# EAGLE design LB1 (EAGLE 9.6.2)
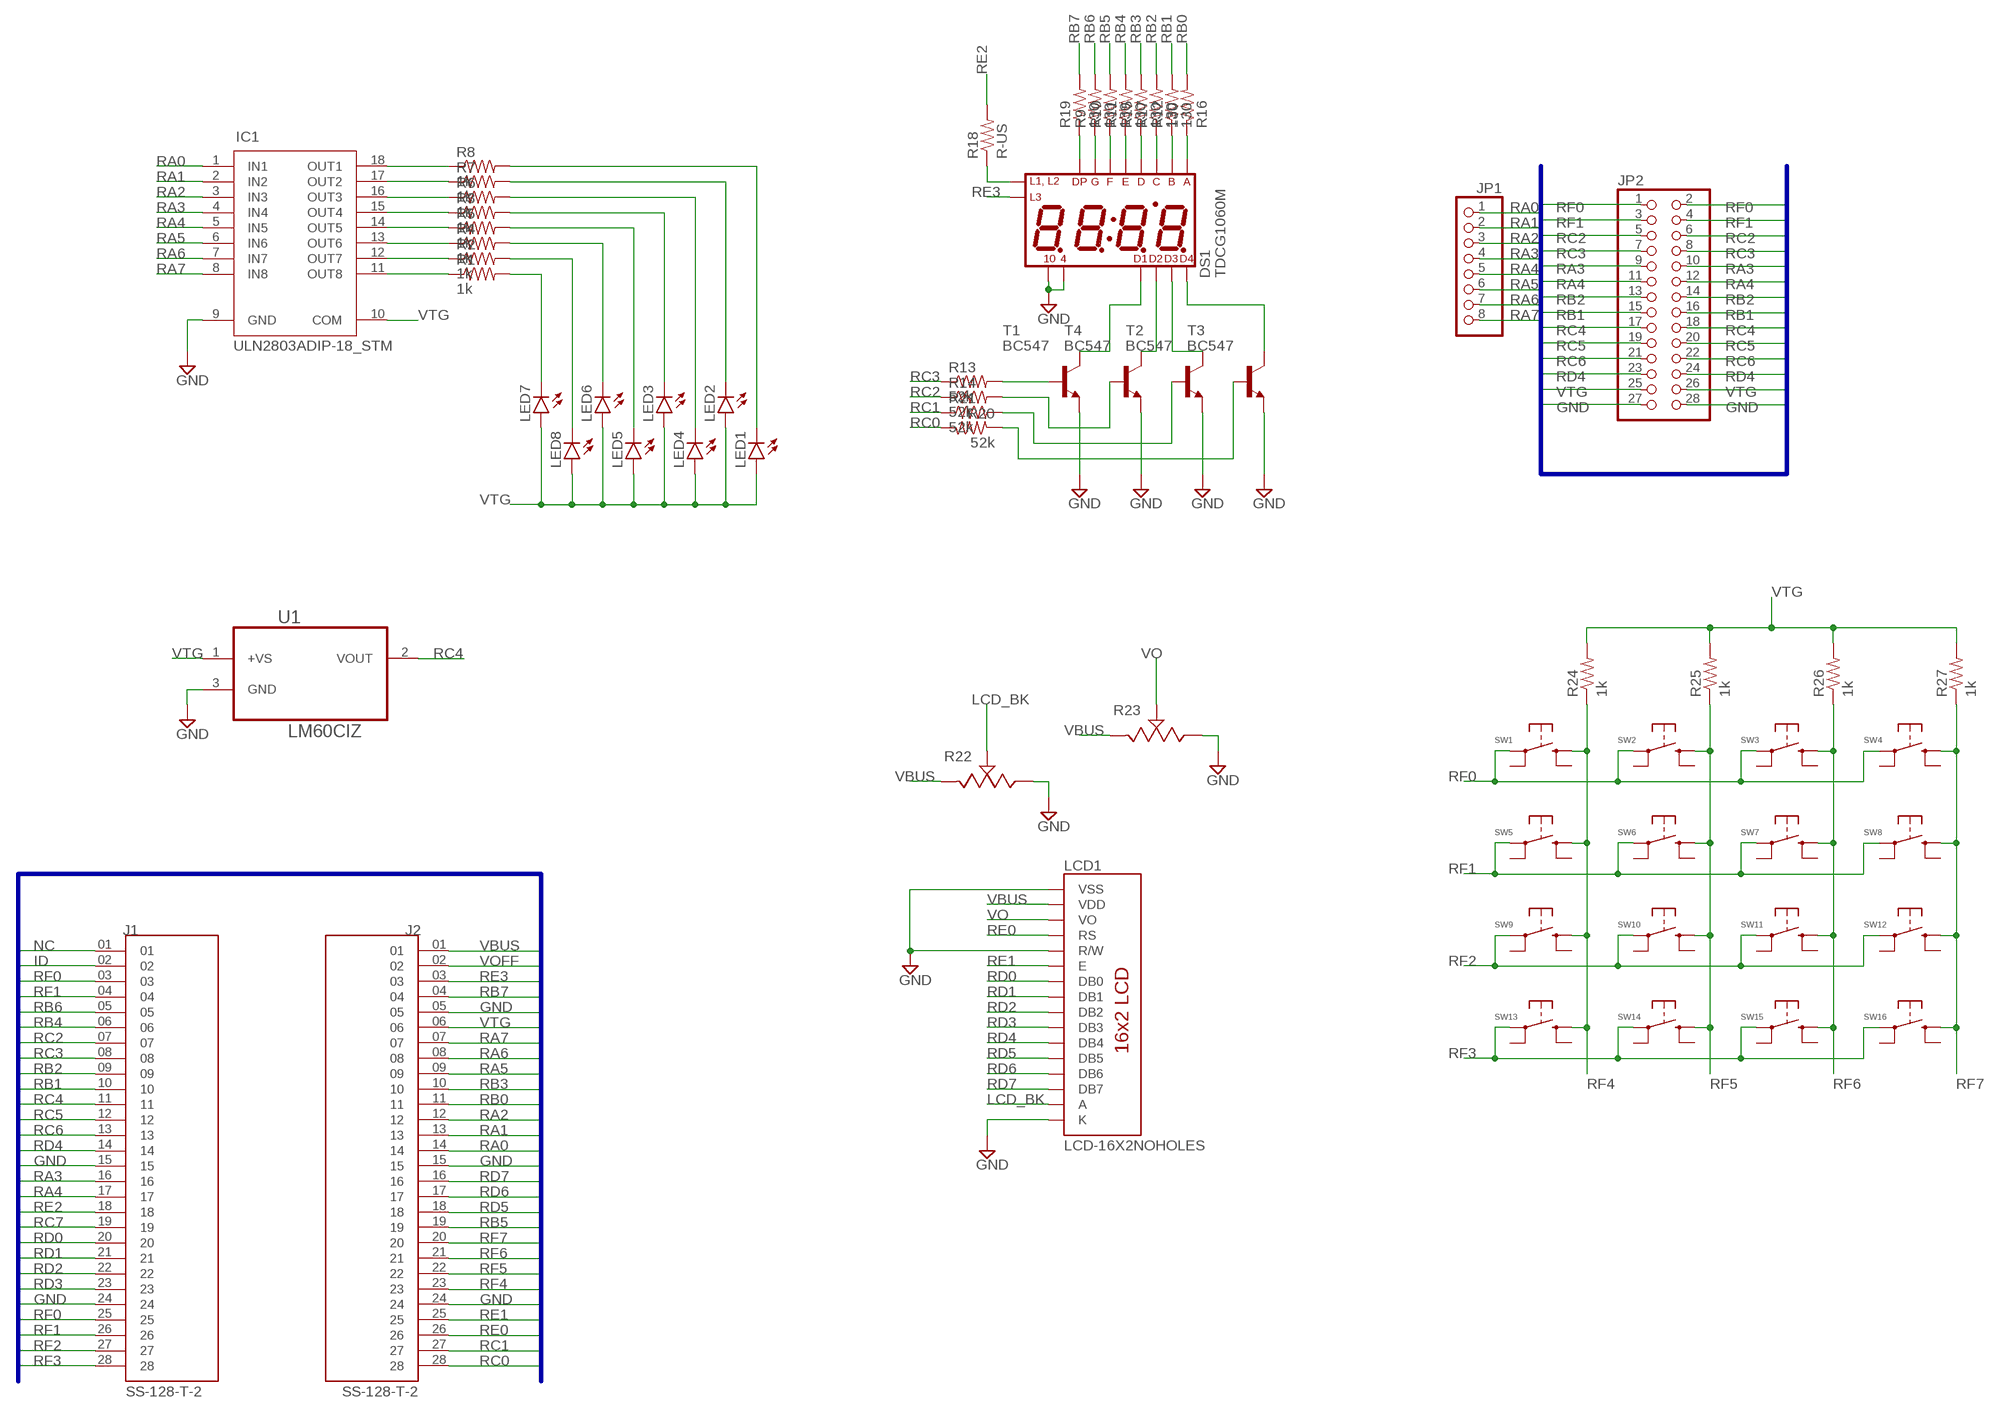
[diagram p0: schematic, sheet 1]

## Parts
DS1  TDCG1060M  [DISPLAY_TDCG1060M]
IC1  ULN2803ADIP-18_STM  [DIP-18_STM]
J1  SS-128-T-2  [SAMTEC_SS-128-T-2]
J2  SS-128-T-2  [SAMTEC_SS-128-T-2]
JP1  PINHD-1X8BIG  [1X08-BIG]
JP2  PINHD-2X14-CB  [2X14-BIG]
LCD1  LCD-16X2NOHOLES  [LCD-16X2_NOHOLESNOSILK]
LED1  LED3MM  [LED3MM]
LED2  LED3MM  [LED3MM]
LED3  LED3MM  [LED3MM]
LED4  LED3MM  [LED3MM]
LED5  LED3MM  [LED3MM]
LED6  LED3MM  [LED3MM]
LED7  LED3MM  [LED3MM]
LED8  LED3MM  [LED3MM]
R1  1k  R-US  [0207/10]
R2  1k  R-US  [0207/10]
R3  1k  R-US  [0207/10]
R4  1k  R-US  [0207/10]
R5  1k  R-US  [0207/10]
R6  1k  R-US  [0207/10]
R7  1k  R-US  [0207/10]
R8  1k  R-US  [0207/10]
R9  130  R-US  [0207/10]
R10  130  R-US  [0207/10]
R11  130  R-US  [0207/10]
R12  130  R-US  [0207/10]
R13  52k  R-US  [0207/10]
R14  52k  R-US  [0207/10]
R15  130  R-US  [0207/10]
R16  130  R-US  [0207/10]
R17  130  R-US  [0207/10]
R18  R-US  [0207/10]
R19  130  R-US  [0207/10]
R20  52k  R-US  [0207/10]
R21  52k  R-US  [0207/10]
R22  3362P-1-103LF  [3362P-1-103LF]
R23  3362P-1-103LF  [3362P-1-103LF]
R24  1k  R-US  [0207/10]
R25  1k  R-US  [0207/10]
R26  1k  R-US  [0207/10]
R27  1k  R-US  [0207/10]
SW1  1825910-2  [TE_1825910-2]
SW2  1825910-2  [TE_1825910-2]
SW3  1825910-2  [TE_1825910-2]
SW4  1825910-2  [TE_1825910-2]
SW5  1825910-2  [TE_1825910-2]
SW6  1825910-2  [TE_1825910-2]
SW7  1825910-2  [TE_1825910-2]
SW8  1825910-2  [TE_1825910-2]
SW9  1825910-2  [TE_1825910-2]
SW10  1825910-2  [TE_1825910-2]
SW11  1825910-2  [TE_1825910-2]
SW12  1825910-2  [TE_1825910-2]
SW13  1825910-2  [TE_1825910-2]
SW14  1825910-2  [TE_1825910-2]
SW15  1825910-2  [TE_1825910-2]
SW16  1825910-2  [TE_1825910-2]
T1  BC547  [TO92]
T2  BC547  [TO92]
T3  BC547  [TO92]
T4  BC547  [TO92]
U1  LM60CIZ  [TO92/]

## Nets
GND: DS1.4 DS1.10 IC1.9(GND) J1.15 J1.24 J2.05 J2.15 J2.24 JP2.27 JP2.28 LCD1.1(VSS) LCD1.5(R/W) LCD1.16(K) R22.3 R23.3 T1.1(E) T2.1(E) T3.1(E) T4.1(E) U1.3(GND)
ID: J1.02
LCD_BK: LCD1.15(A) R22.2
N$1: IC1.11(OUT8) R1.1
N$2: IC1.15(OUT4) R3.1
N$3: IC1.18(OUT1) R8.1
N$4: IC1.17(OUT2) R7.1
N$5: IC1.16(OUT3) R6.1
N$6: IC1.14(OUT5) R5.1
N$7: IC1.13(OUT6) R4.1
N$8: IC1.12(OUT7) R2.1
N$9: LED7.K(C) R1.2
N$10: LED8.K(C) R2.2
N$11: LED6.K(C) R4.2
N$12: LED5.K(C) R5.2
N$13: LED3.K(C) R3.2
N$14: LED4.K(C) R6.2
N$15: LED2.K(C) R7.2
N$16: LED1.K(C) R8.2
N$17: DS1.15(G) R9.1
N$18: DS1.7(DP) R19.1
N$20: DS1.5(E) R11.1
N$21: DS1.3(D) R15.1
N$22: DS1.13(C) R17.1
N$23: DS1.16(B) R12.1
N$24: DS1.14(A) R16.1
N$32: DS1.12(L1_L2) R18.1
N$35: R13.2 T1.2(B)
N$36: R14.2 T4.2(B)
N$37: R21.2 T2.2(B)
N$38: DS1.1(DIG1) T1.3(C)
N$39: R20.1 T3.2(B)
N$40: DS1.2(DIG2) T4.3(C)
N$41: DS1.6(DIG3) T2.3(C)
N$42: DS1.8(DIG4) T3.3(C)
NC: J1.01
RA0: IC1.1(IN1) J2.14 JP1.1
RA1: IC1.2(IN2) J2.13 JP1.2
RA2: IC1.3(IN3) J2.12 JP1.3
RA3: IC1.4(IN4) J1.16 JP1.4 JP2.9 JP2.10
RA4: IC1.5(IN5) J1.17 JP1.5 JP2.11 JP2.12
RA5: IC1.6(IN6) J2.09 JP1.6
RA6: IC1.7(IN7) J2.08 JP1.7
RA7: IC1.8(IN8) J2.07 JP1.8
RB0: J2.11 R16.2
RB1: J1.10 JP2.15 JP2.16 R12.2
RB2: J1.09 JP2.13 JP2.14 R17.2
RB3: J2.10 R15.2
RB4: J1.06 R11.2
RB5: J2.19 R10.2
RB6: DS1.11(F) J1.05 R9.2 R10.1
RB7: J2.04 R19.2
RC0: J2.28 R20.2
RC1: J2.27 R21.1
RC2: J1.07 JP2.5 JP2.6 R14.1
RC3: J1.08 JP2.7 JP2.8 R13.1
RC4: J1.11 JP2.17 JP2.18 U1.2(VOUT)
RC5: J1.12 JP2.19 JP2.20
RC6: J1.13 JP2.21 JP2.22
RC7: J1.19
RD0: J1.20 LCD1.7(DB0)
RD1: J1.21 LCD1.8(DB1)
RD2: J1.22 LCD1.9(DB2)
RD3: J1.23 LCD1.10(DB3)
RD4: J1.14 JP2.23 JP2.24 LCD1.11(DB4)
RD5: J2.18 LCD1.12(DB5)
RD6: J2.17 LCD1.13(DB6)
RD7: J2.16 LCD1.14(DB7)
RE0: J2.26 LCD1.4(RS)
RE1: J2.25 LCD1.6(E)
RE2: J1.18 R18.2
RE3: DS1.9(L3) J2.03
RF0: J1.03 J1.25 JP2.1 JP2.2 SW1.1(P) SW2.1(P) SW3.1(P) SW4.1(P)
RF1: J1.04 J1.26 JP2.3 JP2.4 SW5.1(P) SW6.1(P) SW7.1(P) SW8.1(P)
RF2: J1.27 SW9.1(P) SW10.1(P) SW11.1(P) SW12.1(P)
RF3: J1.28 SW13.1(P) SW14.1(P) SW15.1(P) SW16.1(P)
RF4: J2.23 R24.1 SW1.2(S) SW5.2(S) SW9.2(S) SW13.2(S)
RF5: J2.22 R25.1 SW2.2(S) SW6.2(S) SW10.2(S) SW14.2(S)
RF6: J2.21 R26.1 SW3.2(S) SW7.2(S) SW11.2(S) SW15.2(S)
RF7: J2.20 R27.1 SW4.2(S) SW8.2(S) SW12.2(S) SW16.2(S)
VBUS: J2.01 LCD1.2(VDD) R22.1 R23.1
VO: LCD1.3(VO) R23.2
VOFF: J2.02
VTG: IC1.10(COM) J2.06 JP2.25 JP2.26 LED1.A LED2.A LED3.A LED4.A LED5.A LED6.A LED7.A LED8.A R24.2 R25.2 R26.2 R27.2 U1.1(+VS)
Unconnected: SW1.3(P1) SW1.4(S1) SW2.3(P1) SW2.4(S1) SW3.3(P1) SW3.4(S1) SW4.3(P1) SW4.4(S1) SW5.3(P1) SW5.4(S1) SW6.3(P1) SW6.4(S1) SW7.3(P1) SW7.4(S1) SW8.3(P1) SW8.4(S1) SW9.3(P1) SW9.4(S1) SW10.3(P1) SW10.4(S1) SW11.3(P1) SW11.4(S1) SW12.3(P1) SW12.4(S1) SW13.3(P1) SW13.4(S1) SW14.3(P1) SW14.4(S1) SW15.3(P1) SW15.4(S1) SW16.3(P1) SW16.4(S1)

## Buses
MAIN_BUS:GND,ID,NC,RA[0..7],RB[0..7],RC[0..7],RD[0..7],RE[0..7],RF[0..7],VBUS,VOFF,VTG
SERIAL_COMMUNICATIONS:GND,ID,NC,RA[0..7],RB[0..7],RC[0..7],RD[0..7],RE[0..7],RF[0..7],VBUS,VOFF,VTG

## Library data of the parts
DS1 = TE2015_Microcontroladores:TDCG1060M: Clockmodule 10mm Green m.Plex c.c.-E4; DESCRIPTION: Display Modules - LED Character and Numeric Green 7-Segment Clock 4 Character Common Cathode 2V 20mA 0.504 H x 1.583 W x 0.276 D (12.80mm x 40.20mm x 7.00mm) 16-DIP (0.400, 10.16mm); DIGI-KEY_PART_NUMBER: TDCG1060M-ND; MF: Vishay; MP: TDCG1060M; PACKAGE: None; PURCHASE-URL: https://pricing.snapeda.com/search/part/TDCG1060M/?ref=eda
IC1 = TE2015_Microcontroladores:ULN2803A; COPYRIGHT: Copyright (C) 2022 Ultra Librarian. All rights reserved.; DIGI-KEY_PART_NUMBER_1: 497-2356-5-ND; MANUFACTURER_PART_NUMBER: ULN2803A; MFR_NAME: STMicroelectronics
J1 J2 = TE2015_Microcontroladores:SS-128-T-2; DESCRIPTION: 28 Position Receptacle Connector 0.100 (2.54mm) Through Hole Gold; DIGI-KEY_PART_NUMBER: SAM1117-28-ND; MF: Samtec; MP: SS-128-T-2; PACKAGE: None; PURCHASE-URL: https://pricing.snapeda.com/search/part/SS-128-T-2/?ref=eda
JP1 = TE2015_Microcontroladores:PINHD-1X8: PIN HEADER
JP2 = TE2015_Microcontroladores:PINHD-2X14: PIN HEADER
LCD1 = TE2015_Microcontroladores:LCD-16X2: Standard text-only 16x2 parallel input LCD Basic 16 character by 2 line display. Typically utilizes the extremely common HD44780 parallel interface chipset SparkFun Products: Basic 16x2 Green <https://www.sparkfun.com/products/255> Basic 8x2 Green <https://www.sparkfun.com/products/11122>; SF_ID: LCD-00255
LED1-LED8 = TE2015_Microcontroladores:LED3MM
R1-R21 R24-R27 = TE2015_Microcontroladores:R-US; SPICEPREFIX: R
R22 R23 = TE2015_Microcontroladores:3362P-1-103LF: TRIMMER 10K OHM 0.5W PC PIN TOP Manufacturer's datasheet <https://www.bourns.com/docs/Product-Datasheets/3362.pdf>; CREATED_PN: PCBLayout.com; DIGIKEY_PN: 3362P-103LF-ND; MANUFACTURER: Bourns Inc.; MPN: 3362P-1-103LF
SW1-SW16 = TE2015_Microcontroladores:1825910-2: SWITCH TACTILE SPST-NO 0.05A 24V Check availability <https://pricing.snapeda.com/parts/1825910-2/TE%20Connectivity/view-part?ref=eda>; AVAILABILITY: In Stock; COMMENT: 1825910-2; CONFIGURATION_POLE-THROW: Single Pole - Single Throw; CONTACT_CURRENT_RATING: 50 mA; DESCRIPTION: 50 mA SPST Round Actuator 160 Gram Force Tactile Pushbutton Switch; EU_ROHS_COMPLIANCE: Compliant; MF: TE Connectivity; MP: 1825910-2; PACKAGE: None; PRICE: None; PURCHASE-URL: https://pricing.snapeda.com/search/part/1825910-2/?ref=eda
T1-T4 = transistor:BC547: NPN TRANSISTOR
U1 = TE2015_Microcontroladores:LM60CIZ: IC, TEMPERATURE SENSOR, ± 3°C

## Board
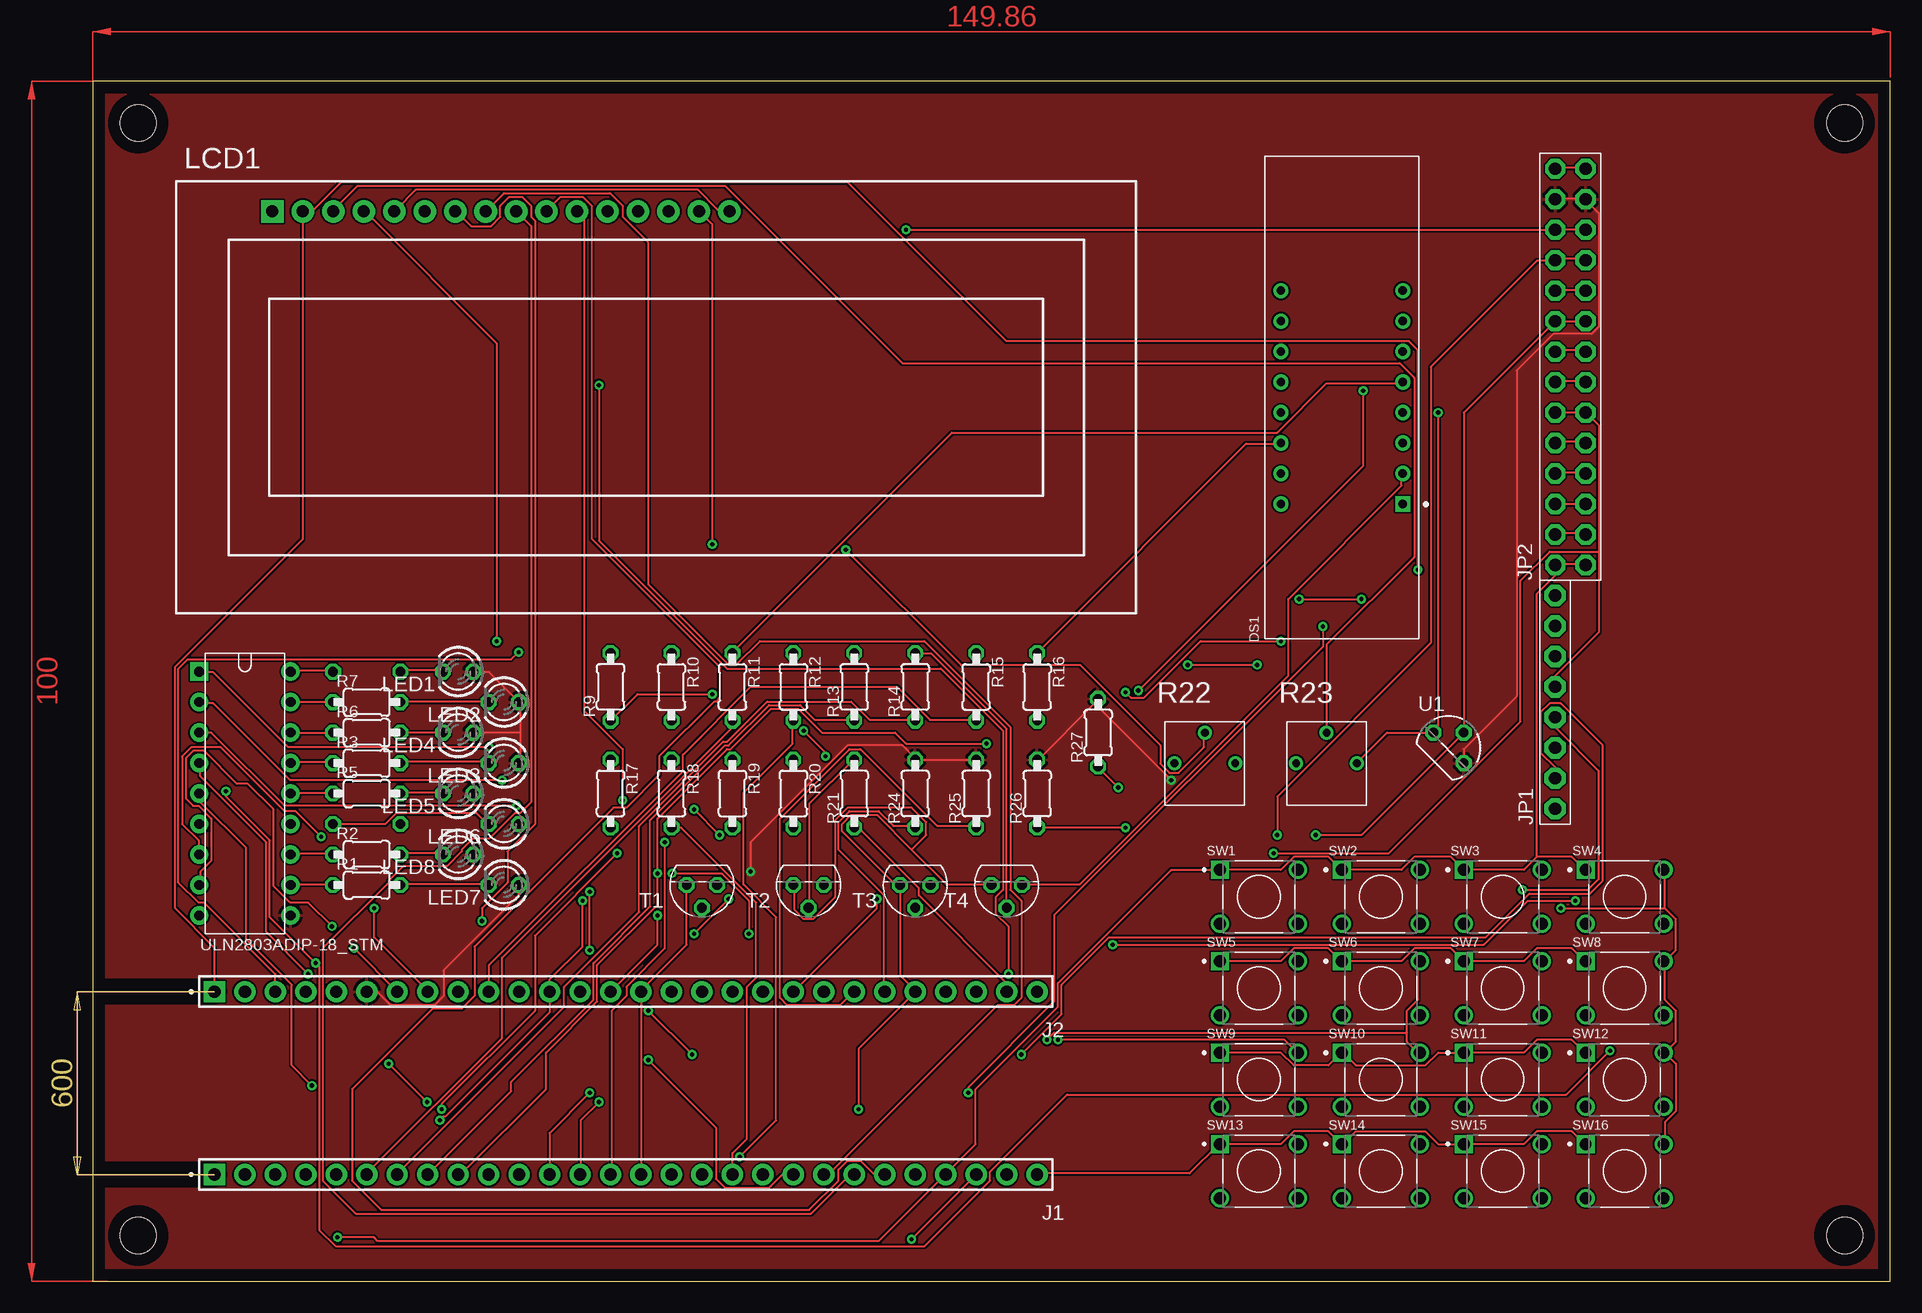
[diagram p1: board, top side]
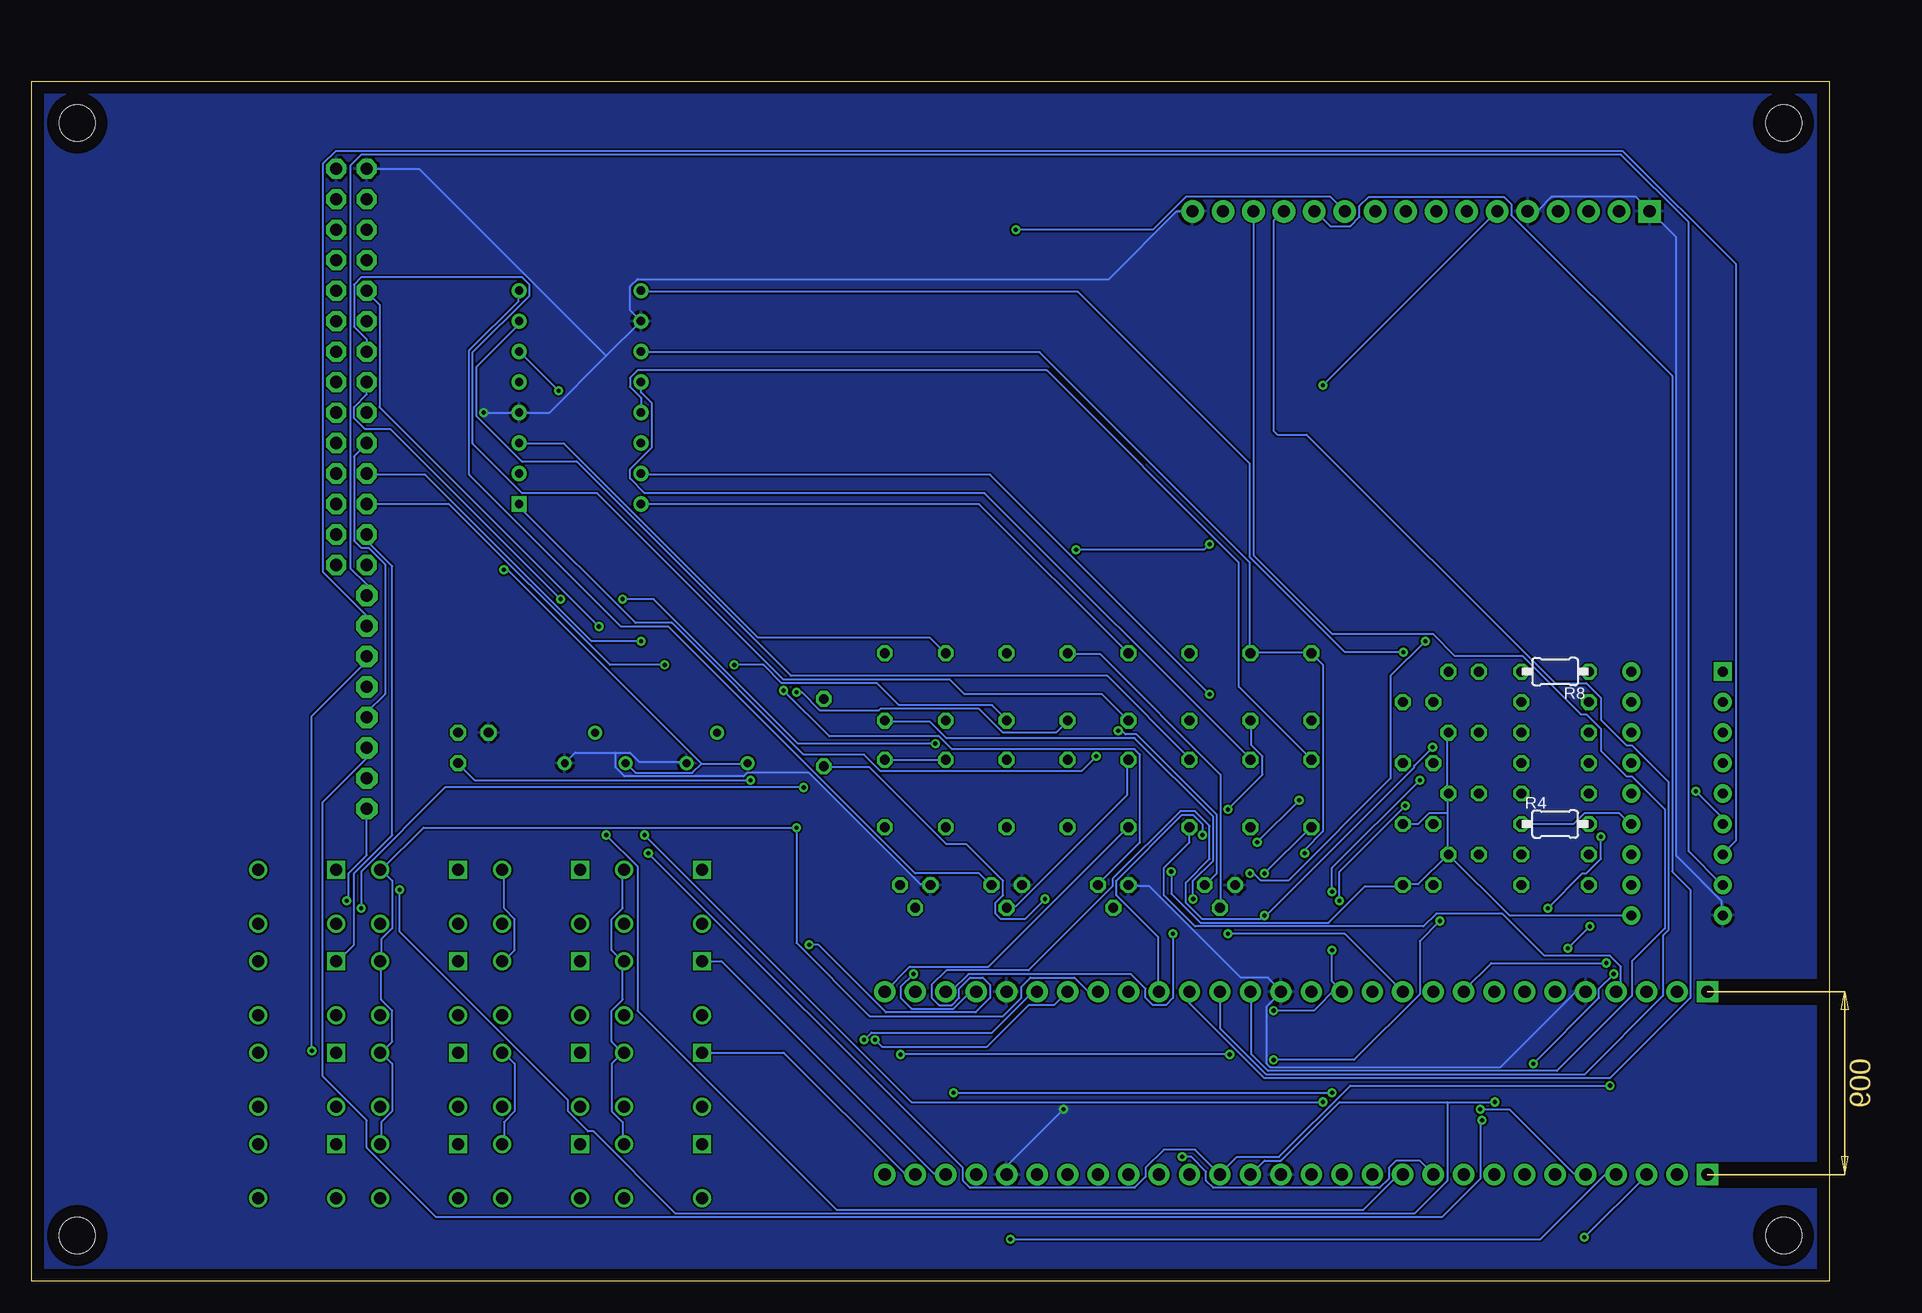
[diagram p2: board, bottom side, seen from below]

Size 149.84 x 100 mm. Coordinates in mm from the lower left corner, seen from the top.
Outline: 0,0 149.84,0 149.84,100 0,100 0,0
Copper layers (1*16): Top 0.035mm / dielectric 1.5mm / Bottom 0.035mm
Design rules "default": minimum track width 6mil, minimum drill 0.35mm, track to track 6mil, track to pad 6mil, pad to pad 6mil, via to via 6mil, smd to smd 6mil, copper to edge 40mil, drill to drill 6mil, minimum pad ring 10mil, minimum via ring 8mil, stop-mask expansion 4mil, vias tented up to drill 0mil, thermal gap 10mil
Holes 3 mm at 3.81,96.52 3.81,3.81 146.05,3.81 146.05,96.52

### Footprints (pad centres in the part's own frame; a part is rotated, then mirrored left to right if it is on the bottom)
DISPLAY_TDCG1060M = drill 0.7 pad 1.27 square: 1 -8.89,-5.08 | drill 0.7 pad 1.27: 2 -6.35,-5.08; 3 -3.81,-5.08; 4 -1.27,-5.08; 5 1.27,-5.08; 6 3.81,-5.08; 7 6.35,-5.08; 8 8.89,-5.08; 9 8.89,5.08; 10 6.35,5.08; 11 3.81,5.08; 12 1.27,5.08; 13 -1.27,5.08; 14 -3.81,5.08; 15 -6.35,5.08; 16 -8.89,5.08
DIP-18_STM = drill 0.813 pad 1.524 square: 1 0,0 | drill 0.813 pad 1.524: 2 0,-2.54; 3 0,-5.08; 4 0,-7.62; 5 0,-10.16; 6 0,-12.7; 7 0,-15.24; 8 0,-17.78; 9 0,-20.32; 10 7.62,-20.32; 11 7.62,-17.78; 12 7.62,-15.24; 13 7.62,-12.7; 14 7.62,-10.16; 15 7.62,-7.62; 16 7.62,-5.08; 17 7.62,-2.54; 18 7.62,0
SAMTEC_SS-128-T-2 = drill 1.016 pad 1.778 square: 01 0,0 | drill 1.016 pad 1.778: 02 -2.54,0; 03 -5.08,0; 04 -7.62,0; 05 -10.16,0; 06 -12.7,0; 07 -15.24,0; 08 -17.78,0; 09 -20.32,0; 10 -22.86,0; 11 -25.4,0; 12 -27.94,0; 13 -30.48,0; 14 -33.02,0; 15 -35.56,0; 16 -38.1,0; 17 -40.64,0; 18 -43.18,0; 19 -45.72,0; 20 -48.26,0; 21 -50.8,0; 22 -53.34,0; 23 -55.88,0; 24 -58.42,0; 25 -60.96,0; 26 -63.5,0; 27 -66.04,0; 28 -68.58,0
1X08-BIG = drill 1.016 pad 1.778 octagon: 1 -8.89,0; 2 -6.35,0; 3 -3.81,0; 4 -1.27,0; 5 1.27,0; 6 3.81,0; 7 6.35,0; 8 8.89,0
2X14-BIG = drill 1.016 pad 1.676 octagon: 1 -16.51,-1.27; 2 -16.51,1.27; 3 -13.97,-1.27; 4 -13.97,1.27; 5 -11.43,-1.27; 6 -11.43,1.27; 7 -8.89,-1.27; 8 -8.89,1.27; 9 -6.35,-1.27; 10 -6.35,1.27; 11 -3.81,-1.27; 12 -3.81,1.27; 13 -1.27,-1.27; 14 -1.27,1.27; 15 1.27,-1.27; 16 1.27,1.27; 17 3.81,-1.27; 18 3.81,1.27; 19 6.35,-1.27; 20 6.35,1.27; 21 8.89,-1.27; 22 8.89,1.27; 23 11.43,-1.27; 24 11.43,1.27; 25 13.97,-1.27; 26 13.97,1.27; 27 16.51,-1.27; 28 16.51,1.27
LCD-16X2_NOHOLESNOSILK = drill 1.016 pad 1.88 square: 1 -32,15.5 | drill 1.016 pad 1.88: 2 -29.46,15.5; 3 -26.92,15.5; 4 -24.38,15.5; 5 -21.84,15.5; 6 -19.3,15.5; 7 -16.76,15.5; 8 -14.22,15.5; 9 -11.68,15.5; 10 -9.14,15.5; 11 -6.6,15.5; 12 -4.06,15.5; 13 -1.52,15.5; 14 1.02,15.5; 15 3.56,15.5; 16 6.1,15.5
LED3MM = drill 0.813 octagon: A -1.27,0; K 1.27,0
0207/10 = drill 0.813 octagon: 1 -1.54,0; 2 4.08,0
3362P-1-103LF = drill 0.66: 1 -2.54,0; 2 0,2.54; 3 2.54,0
TE_1825910-2 = drill 0.99 square: 1 0,0 | drill 0.99: 2 6.5,0; 3 0,-4.5; 4 6.5,-4.5
TO92 = drill 0.813 octagon: 1 1.27,0; 2 0,1.905; 3 -1.27,0
TO92/ = drill 0.813 octagon: 1 1.27,-1.27; 2 1.27,1.27; 3 -1.27,1.27

### Placement (x,y rotation side)
DS1  104.14,73.66 90 top
IC1  8.89,50.8 0 top
J1  10.16,8.89 180 top
J2  10.16,24.13 180 top
JP1  121.92,48.26 90 top
JP2  123.19,76.2 90 top
LCD1  46.99,73.66 0 top
LED1  30.48,50.8 180 top
LED2  34.29,48.26 180 top
LED3  34.29,43.18 180 top
LED4  30.48,45.72 180 top
LED5  30.48,40.64 180 top
LED6  34.29,38.1 180 top
LED7  34.29,33.02 180 top
LED8  30.48,35.56 180 top
R1  21.59,33.02 0 top
R2  21.59,35.56 0 top
R3  21.59,43.18 0 top
R4  24.13,38.1 0 bottom
R5  21.59,40.64 0 top
R6  21.59,45.72 0 top
R7  21.59,48.26 0 top
R8  21.59,50.8 180 bottom
R9  43.18,48.26 90 top
R10  48.26,50.8 270 top
R11  53.34,50.8 270 top
R12  58.42,50.8 270 top
R13  63.5,48.26 90 top
R14  68.58,48.26 90 top
R15  73.66,50.8 270 top
R16  78.74,50.8 270 top
R17  43.18,41.91 270 top
R18  48.26,41.91 270 top
R19  53.34,41.91 270 top
R20  58.42,41.91 270 top
R21  63.5,39.37 90 top
R22  92.71,43.18 0 top
R23  102.87,43.18 0 top
R24  68.58,39.37 90 top
R25  73.66,39.37 90 top
R26  78.74,39.37 90 top
R27  83.82,44.45 90 top
SW1  93.98,34.29 0 top
SW2  104.14,34.29 0 top
SW3  114.3,34.29 0 top
SW4  124.46,34.29 0 top
SW5  93.98,26.67 0 top
SW6  104.14,26.67 0 top
SW7  114.3,26.67 0 top
SW8  124.46,26.67 0 top
SW9  93.98,19.05 0 top
SW10  104.14,19.05 0 top
SW11  114.3,19.05 0 top
SW12  124.46,19.05 0 top
SW13  93.98,11.43 0 top
SW14  104.14,11.43 0 top
SW15  114.3,11.43 0 top
SW16  124.46,11.43 0 top
T1  50.8,33.02 180 top
T2  59.69,33.02 180 top
T3  68.58,33.02 180 top
T4  76.2,33.02 180 top
U1  113.03,44.45 0 top

### Tracks (layer width: path | path; a pad name or v marks a point on that pad's centre or on a via)
GND  (via drill 0.35)
  Top 0.152: LCD1.16 53.03,89.31 52.12,89.31 50.44,90.98 26.98,90.98 25.3,89.31 LCD1.5 | T1.1 49.53,28.04 45.72,24.23 J2.15 J1.15 | JP2.28 121.92,92.81 124.36,92.81 JP2.27 | R23.3 105.46,43.28 107.9,45.72 U1.3 111.86,45.72 112.17,46.02 v112.17,72.39 | 68.28,35.97 65.38,38.86 63.25,38.86 62.48,38.1 62.48,37.49 66.9,33.07 67.21,33.07 T3.1 67.36,32.92 67.36,25.45 68.58,24.23 J2.24 68.58,24.08 63.86,19.36 v63.86,14.33 | 68.28,35.97 71.17,33.07 74.83,33.07 T4.1 | 68.28,35.97 69.49,37.19 69.49,38.25 68.28,39.47 62.94,39.47 61.87,38.41 61.87,32 60.05,30.18 59.28,30.18 58.52,30.94 58.52,32.92 T2.1
  Bottom 0.152: IC1.9 8.99,30.48 8.99,31.7 12.8,35.51 12.8,87.02 14.94,89.15 LCD1.1 15.09,89.31 16.15,90.37 23.16,90.37 24.23,89.31 25.15,89.31 LCD1.5 | T2.1 58.37,32.92 56.69,32.92 49.07,25.3 46.79,25.3 45.72,24.23 J2.15 45.72,24.08 46.94,22.86 46.94,18.14 46.63,17.83 27.43,17.83 21.18,24.08 20.42,24.08 J2.05 | 101.96,77.11 106.68,72.39 DS1.4 v112.17,72.39 | 101.96,77.11 DS1.10 99.97,80.92 99.97,82.91 99.36,83.52 60.05,83.52 54.41,89.15 53.19,89.15 LCD1.16 | 101.96,77.11 117.5,92.66 121.92,92.66 JP2.28 | 101.19,44.04 104.55,44.04 R23.3 | 101.19,44.04 99.97,44.04 99.21,43.28 95.25,43.28 R22.3 | J1.24 68.58,9.6 v63.86,14.33 | 101.19,44.04 101.19,42.82 100.43,42.06 90.53,42.06 90.22,42.37 85.04,42.37 75.74,33.07 74.98,33.07 T4.1
  pour Bottom: 0,100.33 0,0 149.86,0 149.86,100.33
LCD_BK  (via drill 0.35)
  Top 0.152: v62.79,60.96 72.39,51.36 82.3,51.36 89,44.65 89,43.13 89.76,42.37 90.53,42.37 92.66,44.5 92.66,45.72 R22.2 | v51.66,61.42 51.66,88.09 50.6,89.15 LCD1.15
  Bottom 0.152: v62.79,60.96 52.12,60.96 v51.66,61.42
N$1
  Top 0.152: R1.1 19.96,33.07 16.61,33.07 IC1.11
N$2
  Top 0.152: R3.1 19.96,43.28 16.61,43.28 IC1.15
N$3
  Top 0.152: R8.1 19.96,50.9 16.61,50.9 IC1.18
N$4
  Top 0.152: R7.1 19.96,48.31 16.61,48.31 IC1.17
N$5
  Top 0.152: IC1.16 R6.1
N$6
  Top 0.152: R5.1 19.96,40.69 16.61,40.69 IC1.14
N$7
  Bottom 0.152: R4.1 21.34,38.1 20.42,39.01 17.53,39.01 16.61,38.1 IC1.13
N$8
  Top 0.152: R2.1 19.96,35.66 16.61,35.66 IC1.12
N$9
  Top 0.152: R1.2 25.76,33.07 32.92,33.07 LED7.K
N$10
  Top 0.152: R2.2 25.76,35.66 29.11,35.66 LED8.K
N$11
  Top 0.152: R4.2 24.38,38.1 25.3,39.01 32,39.01 32.92,38.1 LED6.K
N$12
  Top 0.152: R5.2 25.76,40.69 29.11,40.69 LED5.K
N$13
  Top 0.152: R3.2 25.76,43.28 32.92,43.28 LED3.K
N$14
  Top 0.152: LED4.K R6.2
N$15
  Top 0.152: R7.2 25.76,48.31 32.92,48.31 LED2.K
N$16
  Top 0.152: R8.2 25.76,50.9 29.11,50.9 LED1.K
N$17  (via drill 0.35)
  Top 0.152: v51.66,48.92 45.41,48.92 43.28,46.79 R9.1
  Bottom 0.152: v51.66,48.92 69.95,67.21 99.06,67.21 DS1.15
N$18
  Bottom 0.152: DS1.7 109.27,80.01 109.27,79.7 112.78,76.2 112.78,72.08 108.97,68.28 104.39,68.28 86.56,50.44 60.2,50.44 53.34,43.59 R19.1
N$20
  Top 0.152: DS1.5 109.12,74.83 102.87,74.83 98.75,70.71 71.63,70.71 53.34,52.43 R11.1
N$21
  Bottom 0.152: DS1.3 109.12,69.8 105.46,69.8 89.31,53.65 74.98,53.65 73.76,52.43 R15.1
N$22
  Bottom 0.152: DS1.13 99.06,73.61 99.97,74.52 99.97,75.29 99.36,75.89 65.23,75.89 49.23,59.89 49.23,49.53 43.28,43.59 R17.1
N$23
  Bottom 0.152: DS1.16 70.87,64.77 58.52,52.43 R12.1
N$24
  Top 0.152: DS1.14 99.06,69.8 96.16,69.8 78.79,52.43 R16.1
N$32
  Bottom 0.152: DS1.12 99.06,74.07 98.15,73.15 98.15,69.49 99.97,67.67 99.97,66.9 98.75,65.68 70.41,65.68 48.31,43.59 R18.1
N$35
  Bottom 0.152: T1.2 50.75,31.24 50.75,42.22 60.81,52.27 63.4,52.27 R13.2
N$36
  Top 0.152: T4.2 76.2,46.02 69.95,52.27 68.58,52.27 R14.2
N$37
  Top 0.152: T2.2 59.74,31.24 59.74,39.78 63.4,43.43 R21.2
N$38  (via drill 0.35)
  Top 0.152: v61.11,43.74 61.11,44.04 v59.28,45.87
  Bottom 0.152: v61.11,43.74 62.33,42.52 79.1,42.52 80.47,43.89 85.5,43.89 96.47,54.86 99.52,54.86 109.12,64.47 109.12,64.77 DS1.1 | v59.28,45.87 58.98,45.87 58.67,45.57 57.76,45.57 51.05,38.86 51.05,33.98 51.97,33.07 T1.3
N$39
  Bottom 0.152: R20.1 58.52,43.43 58.52,40.54 67.82,31.24 68.58,31.24 T3.2
N$40
  Top 0.152: DS1.2 109.12,67.21 109.12,66.29 99.67,56.84 99.67,50.44 82.3,33.07 77.57,33.07 T4.3
N$41  (via drill 0.35)
  Top 0.152: v105.92,74.22 105.92,67.97 v87.17,49.23
  Bottom 0.152: v105.92,74.22 109.12,77.42 DS1.6 | v87.17,49.23 83.36,45.41 74.22,45.41 73.15,44.35 57.91,44.35 57.45,43.89 57.45,36.58 60.96,33.07 T2.3
N$42
  Bottom 0.152: DS1.8 109.27,82.45 109.27,81.69 113.39,77.57 113.39,67.21 100.74,54.56 96.77,54.56 76.2,33.98 70.87,33.98 69.95,33.07 T3.3
RA0  (via drill 0.35)
  Top 0.152: v33.07,44.5 16.31,44.5 10.06,50.75 8.99,50.75 IC1.1 | v47.09,30.48 47.09,28.04 J2.14 | v123.6,31.7 119.63,31.7 115.98,28.04 v85.04,28.04
  Bottom 0.152: v33.07,44.5 34.59,42.98 34.59,42.82 46.94,30.48 v47.09,30.48 47.4,30.18 52.27,30.18 53.65,31.55 53.65,33.22 51.66,35.2 51.66,37.95 52.88,39.17 54.1,39.17 59.74,33.53 59.74,32.92 66.75,25.91 73.61,25.91 74.83,24.69 74.83,23.62 74.22,23.01 73.15,23.01 72.54,23.62 72.54,24.38 71.63,25.3 70.56,25.3 69.95,24.69 69.95,23.62 71.17,22.4 78.64,22.4 84.28,28.04 v85.04,28.04 | JP1.1 121.92,35.51 123.44,33.98 123.44,31.85 v123.6,31.7
RA1  (via drill 0.35)
  Top 0.152: v34.14,41.76 16.46,41.76 10.06,48.16 8.99,48.16 IC1.2 | v41.45,27.58 v41.45,32.46 | JP1.2 121.92,42.82 120.7,44.04 120.7,47.4 121.46,48.16 122.38,48.16 125.88,44.65 125.88,33.38 124.82,32.31 119.79,32.31 116.13,28.65 84.73,28.65 80.77,24.69 80.77,22.25 v77.42,18.9 | v46.33,22.55 v49.99,18.9
  Bottom 0.152: v34.14,41.76 41.45,34.44 v41.45,32.46 | v41.45,27.58 41.45,24.99 41,24.54 | 41,24.54 40.69,24.23 J2.13 41,24.54 | v49.99,18.9 v77.42,18.9 | v46.33,22.55 42.98,22.55 41,24.54
RA2  (via drill 0.35)
  Top 0.152: IC1.3 9.91,45.72 16,39.62 v35.36,39.62 | v40.84,31.7 40.84,27.89 38.1,25.15 J2.12 38.1,22.4 29.41,13.72 29.26,13.72 v28.96,13.41
  Bottom 0.152: v35.36,39.62 40.84,34.14 v40.84,31.7 | JP1.3 121.92,43.59 125.58,39.93 125.58,17.07 121.92,13.41 121.92,11.12 116.13,5.33 32.31,5.33 29.11,8.53 29.11,13.26 v28.96,13.41
RA3  (via drill 0.35)
  Top 0.152: JP2.10 121.92,69.95 124.36,69.95 JP2.9 | v17.98,25.6 14.48,29.11 14.48,36.58 8.99,42.06 8.99,43.13 IC1.4 | v27.89,14.94 v24.69,18.14 | JP1.4 121.92,46.18 125.58,42.52 125.58,33.53 124.66,32.61 v119.18,32.61
  Bottom 0.152: JP1.4 121.92,47.4 120.4,48.92 120.4,59.74 121.77,61.11 122.38,61.11 122.99,61.72 122.99,68.73 121.92,69.8 JP2.10 | v17.98,25.6 19.2,24.38 19.2,23.62 v24.69,18.14 | 31.85,14.94 40.84,14.94 45.72,10.06 47.09,10.06 J1.16 | 31.85,14.94 v27.89,14.94 | v119.18,32.61 119.18,29.11 105.16,15.09 105.16,14.17 103.48,12.5 103.02,12.5 96.16,5.64 34.59,5.64 31.85,8.38 31.85,14.94
RA4  (via drill 0.35)
  Top 0.152: JP2.12 JP2.11 124.51,72.39 125.58,71.32 125.58,60.81 | JP1.5 121.92,50.44 125.58,54.1 125.58,60.81 | v18.29,16.31 16.61,17.98 16.61,24.69 12.8,28.5 12.8,36.12 8.99,39.93 8.99,40.54 IC1.5 | 125.58,60.81 121.46,60.81 119.02,58.37 119.02,46.63 108.05,35.66 v98.45,35.66
  Bottom 0.152: v18.29,16.31 39.93,16.31 45.87,10.36 49.38,10.36 50.75,8.99 J1.17 52.88,10.97 55.47,10.97 57,9.45 57,8.69 57.91,7.77 71.63,7.77 72.24,8.38 72.24,9.45 v98.45,35.66
RA5  (via drill 0.35)
  Top 0.152: v11.12,40.84 11.12,40.39 14.78,36.73 14.78,30.33 v18.59,26.52 18.9,26.21 18.9,4.27 20.27,2.9 69.34,2.9 74.83,8.38 74.83,9.14 81.23,15.54 122.83,15.54 v126.49,19.2
  Bottom 0.152: v11.12,40.84 8.99,38.71 8.99,38.1 IC1.6 | v18.59,26.52 28.19,26.52 30.48,24.23 J2.09 | JP1.6 121.92,51.66 126.49,47.09 v126.49,19.2
RA6  (via drill 0.35)
  Top 0.152: v19.05,37.03 16.92,39.17 16,39.17 10.67,44.5 8.23,44.5 7.47,43.74 7.47,38.1 8.84,36.73 8.84,35.66 IC1.7 | v23.47,31.09 23.47,28.65 27.89,24.23 J2.08
  Bottom 0.152: v19.05,37.03 19.05,35.2 20.27,33.98 20.57,33.98 v23.47,31.09 | JP1.7 121.92,55.47 125.58,59.13 125.58,93.12 124.51,94.18 17.22,94.18 7.77,84.73 7.77,36.73 8.84,35.66 IC1.7
RA7  (via drill 0.35)
  Top 0.152: v19.96,29.57 17.98,31.55 16.46,31.55 15.09,32.92 15.09,39.32 12.95,41.45 12.04,41.45 9.3,44.2 8.38,44.2 7.77,43.59 7.77,40.23 8.38,39.62 8.84,39.62 9.91,38.56 9.91,35.05 8.99,34.14 8.99,33.07 IC1.8 | J2.07 v21.79,27.74
  Bottom 0.152: v21.79,27.74 v19.96,29.57 | JP1.8 121.92,58.06 123.29,59.44 123.29,92.96 122.38,93.88 17.37,93.88 11.73,88.24 11.73,35.81 8.99,33.07 IC1.8
RB0  (via drill 0.35)
  Top 0.152: v50.14,28.96 v53.03,31.85
  Bottom 0.152: v53.03,31.85 53.03,33.38 51.36,35.05 51.36,38.71 57.91,45.26 73.61,45.26 74.98,46.63 78.64,46.63 R16.2 | v50.14,28.96 40.39,28.96 J2.11
RB1  (via drill 0.35)
  Top 0.152: JP2.16 121.92,77.57 124.36,77.57 JP2.15 | v53.95,10.36 57,13.41 57,30.33 54.25,33.07 54.25,40.69 58.37,44.81 58.37,46.63 R12.2
  Bottom 0.152: v53.95,10.36 53.19,10.36 51.97,9.14 51.97,8.38 51.36,7.77 37.49,7.77 36.73,8.53 36.73,9.45 36.12,10.06 34.14,10.06 33.07,8.99 J1.10 | JP2.16 121.92,78.49 122.99,79.55 122.99,83.06 122.38,83.67 108.97,83.67 108.36,83.06 108.36,82.14 113.08,77.42 113.08,69.8 108.97,65.68 102.72,65.68 87.17,50.14 73.3,50.14 72.08,48.92 60.66,48.92 58.52,46.79 R12.2
RB2  (via drill 0.35)
  Top 0.152: JP2.14 121.92,74.98 124.36,74.98 JP2.13 | J1.09 30.48,8.99 30.79,8.99 37.8,16 37.8,19.05 42.06,23.32 42.06,26.36 47.09,31.39 v47.09,33.98 47.09,38.56 52.88,44.35 53.19,44.35 56.54,47.7 58.83,47.7 60.81,45.72 66.9,45.72 67.82,44.81 v74.52,44.81 | v100.58,56.84 v105.77,56.84
  Bottom 0.152: v47.09,33.98 43.28,37.8 R17.2 | JP2.14 121.92,73.91 122.99,72.85 122.99,71.93 122.07,71.02 119.94,71.02 v105.77,56.84 | v100.58,56.84 97.99,56.84 85.95,44.81 v74.52,44.81
RB3
  Top 0.152: R15.2 73.61,46.79 69.8,46.79 67.06,49.53 54.86,49.53 49.23,43.89 49.23,42.52 33.07,26.36 33.07,24.23 J2.10
RB4
  Top 0.152: R11.2 53.34,46.18 34.14,26.98 34.14,20.27 22.86,8.99 J1.06
RB5  (via drill 0.35)
  Top 0.152: v52.27,37.19 v50.14,39.32
  Bottom 0.152: v50.14,39.32 47.24,42.22 47.24,43.74 48.16,44.65 48.16,46.63 R10.2 | v52.27,37.19 52.27,38.1 53.03,38.86 53.95,38.86 59.44,33.38 59.44,32.16 55.93,28.65 55.93,24.23 J2.19
RB6  (via drill 0.35)
  Top 0.152: v29.11,14.33 29.11,14.78 36.88,22.55 36.88,28.8 v43.74,35.66
  Bottom 0.152: DS1.11 99.06,77.42 65.84,77.42 48.31,59.89 48.31,52.43 R10.1 48.16,52.43 43.28,52.43 R9.2 43.13,52.27 42.22,51.36 42.22,37.49 43.74,35.97 v43.74,35.66 | v29.11,14.33 26.67,14.33 21.34,8.99 20.42,8.99 J1.05
RB7
  Bottom 0.152: R19.2 53.34,36.58 55.47,34.44 55.47,32.16 52.88,29.57 33.83,29.57 32.77,30.63 27.28,30.63 23.77,27.13 18.29,27.13 17.37,26.21 17.37,24.54 J2.04
RC0
  Bottom 0.152: J2.28 76.66,26.21 70.1,26.21 58.52,37.8 R20.2
RC1
  Top 0.152: J2.27 76.2,24.84 68.89,32.16 68.89,32.77 63.86,37.8 63.55,37.8 R21.1
RC2  (via drill 0.35)
  Top 0.152: JP2.5 JP2.6 | R14.1 68.58,46.79 64.77,46.79 63.25,48.31 56.24,48.31 52.88,44.96 52.58,44.96 45.57,37.95 45.57,30.79 39.32,24.54 39.32,22.86 25.45,8.99 J1.07 | v91.29,51.36 v97.08,51.36
  Bottom 0.152: JP2.6 115.06,64.77 101.65,51.36 v97.08,51.36 | v91.29,51.36 88.85,51.36 87.33,49.84 79.4,49.84 77.57,48.01 69.8,48.01 68.58,46.79 R14.1
RC3  (via drill 0.35)
  Top 0.152: JP2.8 121.92,67.36 124.36,67.36 JP2.7 | J1.08 34.9,15.85 34.9,16.61 41.76,23.47 41.76,26.52 46.48,31.24 46.48,38.41 52.73,44.65 53.03,44.65 56.39,48.01 58.98,48.01 60.2,46.79 63.4,46.79 R13.1 | v99.06,53.34 92.35,53.34 87.63,48.62 86.56,48.62 v86.11,49.07
  Bottom 0.152: v99.06,53.34 103.17,53.34 117.04,67.21 121.92,67.21 JP2.8 | v86.11,49.07 85.65,49.07 84.12,47.55 79.25,47.55 79.1,47.7 70.87,47.7 68.89,45.72 64.47,45.72 63.55,46.63 R13.1
RC4  (via drill 0.35)
  Top 0.152: JP2.17 JP2.18 114.3,72.39 U1.2 105.77,37.19 v101.96,37.19
  Bottom 0.152: v101.96,37.19 99.36,34.59 99.36,22.55 82.75,5.94 38.86,5.94 35.97,8.84 35.66,8.84 J1.11
RC5  (via drill 0.35)
  Top 0.152: JP2.20 121.92,82.6 124.36,82.6 JP2.19 | J1.12 38.1,12.34 v41.45,15.7 | v73,15.7 73,16.15 80.16,23.32 80.16,30.48 102.56,52.88 v102.56,54.56
  Bottom 0.152: v73,15.7 v41.45,15.7 | v102.56,54.56 120.85,72.85 120.85,81.38 121.92,82.45 JP2.20
RC6  (via drill 0.35)
  Top 0.152: JP2.21 124.36,85.19 121.92,85.19 JP2.22 121.92,85.04 120.4,85.04 111.56,76.2 111.56,53.19 98.75,40.39 v98.75,37.19 | v42.22,14.94 40.69,13.41 40.69,8.99 J1.13
  Bottom 0.152: v42.22,14.94 76.5,14.94 v98.75,37.19
RD0  (via drill 0.35)
  Top 0.152: v46.33,18.44 51.97,12.8 51.97,8.53 52.73,7.77 56.39,7.77 57.45,8.84 58.37,8.84 J1.20 | v32.46,30.02 32.46,31.09 34.59,33.22 34.59,35.81 36.88,38.1 36.88,88.39 36.58,88.7 36.58,89.61 35.81,90.37 34.75,90.37 33.98,89.61 33.98,88.7 33.22,87.94 31.55,87.94 30.33,89.15 LCD1.7
  Bottom 0.152: v46.33,18.44 39.62,18.44 34.14,23.93 34.14,28.35 v32.46,30.02
RD1
  Top 0.152: J1.21 60.96,8.99 61.42,8.99 75.44,23.01 76.81,23.01 77.42,23.62 77.42,31.7 76.5,32.61 76.5,46.18 69.34,53.34 55.63,53.34 53.65,51.36 53.03,51.36 46.33,58.06 46.33,86.56 44.2,88.7 44.2,89.61 43.13,90.68 34.29,90.68 32.92,89.31 LCD1.8
RD2
  Top 0.152: J1.22 63.4,8.84 63.09,8.84 59.89,5.64 21.95,5.64 19.2,8.38 19.2,27.74 24.69,33.22 24.69,33.38 25.91,34.59 29.57,34.59 30.79,35.81 30.79,35.97 31.7,36.88 33.07,36.88 35.2,39.01 35.66,39.01 36.58,39.93 36.58,87.94 35.36,89.15 LCD1.9
RD3
  Top 0.152: J1.23 65.99,8.99 65.08,8.99 64.01,10.06 62.94,10.06 62.18,9.3 62.18,8.38 59.74,5.94 24.08,5.94 21.64,8.38 21.64,16 28.35,22.71 30.79,22.71 31.85,23.77 31.85,27.89 43.43,39.47 44.5,39.47 47.24,42.22 47.24,43.74 51.82,48.31 51.97,48.31 52.27,48.62 52.27,51.21 41.6,61.87 41.6,89.61 40.84,90.37 39.01,90.37 37.95,89.31 LCD1.10
RD4  (via drill 0.35)
  Top 0.152: JP2.23 JP2.24 v67.82,87.63 | v47.7,36.58 47.7,27.74 44.5,24.54 44.5,23.77 43.28,22.55 43.28,8.99 J1.14 | v44.2,40.08 44.2,44.35 41,47.55 41,88.7 40.54,89.15 LCD1.11
  Bottom 0.152: v44.2,40.08 v47.7,36.58 | v67.82,87.63 56.39,87.63 53.65,90.37 41.6,90.37 40.54,89.31 LCD1.11
RD5
  Bottom 0.152: J2.18 53.34,23.16 47.09,16.92 18.29,16.92 11.58,23.62 11.58,32.61 13.11,34.14 13.11,75.44 26.52,88.85 26.52,89.76 27.13,90.37 38.41,90.37 39.17,89.61 39.17,88.7 39.93,87.94 41.6,87.94 42.82,89.15 LCD1.12
RD6
  Bottom 0.152: J2.17 50.75,24.08 50.75,21.03 46.94,17.22 20.42,17.22 13.87,23.77 13.87,28.8 13.41,29.26 13.41,41.6 16.46,44.65 16.92,44.65 19.05,46.79 19.05,48.62 20.27,49.84 22.86,49.84 43.59,70.56 46.02,70.56 46.33,70.87 46.33,88.39 45.57,89.15 LCD1.13
RD7
  Bottom 0.152: J2.16 48.16,24.08 48.16,18.9 46.79,17.53 22.71,17.53 16.46,23.77 16.46,26.67 13.72,29.41 13.72,39.32 16.46,42.06 16.92,42.06 19.05,44.2 19.05,46.02 20.27,47.24 20.73,47.24 25.6,52.12 31.24,52.12 33.07,53.95 41.45,53.95 48.01,60.5 LCD1.14
RE0  (via drill 0.35)
  Top 0.152: v54.71,28.96 54.71,31.7 52.43,33.98 v48.31,33.98 | v33.68,53.34 33.68,78.18 22.71,89.15 LCD1.4
  Bottom 0.152: v54.71,28.96 54.71,23.62 55.32,23.01 56.39,23.01 57,23.62 57,24.38 58.22,25.6 71.78,25.6 73.15,24.23 73.61,24.23 J2.26 | v48.31,33.98 48.01,33.98 47.4,33.38 45.11,33.38 36.58,41.91 36.58,50.44 v33.68,53.34
RE1  (via drill 0.35)
  Top 0.152: v76.35,25.6 76.35,29.57 75.29,30.63 75.29,32 75.89,32.61 75.89,45.87 70.71,51.05 52.88,51.05 42.22,61.72 v42.22,74.68
  Bottom 0.152: v76.35,25.6 77.42,24.54 77.42,23.62 76.5,22.71 73,22.71 71.63,24.08 71.17,24.08 J2.25 | v42.22,74.68 27.74,89.15 LCD1.6
RE2
  Top 0.152: J1.18 53.34,10.67 54.56,11.89 54.56,24.54 55.32,25.3 55.32,31.55 49.07,37.8 48.31,37.8 R18.2
RE3  (via drill 0.35)
  Top 0.152: v35.51,52.43 34.9,51.82 7.92,51.82 7.16,51.05 7.16,33.22 8.84,31.55 9.3,31.55 15.24,25.6 J2.03
  Bottom 0.152: v35.51,52.43 40.39,52.43 48.31,60.35 48.31,68.12 62.64,82.45 99.06,82.45 DS1.9
RF0  (via drill 0.35)
  Top 0.152: JP2.1 124.36,59.74 121.92,59.74 JP2.2 121.92,58.83 120.4,57.3 120.4,35.36 | 120.4,35.36 119.33,34.29 SW3.1 113.23,35.36 110.19,35.36 109.12,34.29 SW2.1 104.09,34.29 103.02,35.36 100.13,35.36 99.06,34.29 SW1.1 89.92,34.29 80.47,24.84 80.47,22.86 73.61,16 73.61,11.43 71.17,8.99 J1.25 71.02,8.84 65.53,3.35 23.77,3.35 23.47,3.66 v20.42,3.66 | 120.4,35.36 123.29,35.36 124.36,34.29 SW4.1
  Bottom 0.152: v20.42,3.66 15.24,8.84 J1.03
RF1  (via drill 0.35)
  Top 0.152: J1.26 v68.28,3.5 | SW5.1 99.06,26.67 100.13,27.74 103.02,27.74 104.09,26.67 SW6.1 109.12,26.67 110.19,27.74 113.23,27.74 SW7.1 119.33,26.67 120.4,27.74 123.29,27.74 124.36,26.67 SW8.1 | JP2.4 121.92,62.33 124.36,62.33 JP2.3
  Bottom 0.152: v68.28,3.5 24.08,3.5 18.75,8.84 17.83,8.84 J1.04 | JP2.4 121.92,61.72 119.79,59.59 119.79,37.19 122.99,33.98 122.99,28.04 124.36,26.67 SW8.1 | SW5.1 92.35,26.67 74.68,8.99 73.76,8.99 J1.26
RF2
  Top 0.152: SW12.1 124.36,19.05 123.29,20.12 120.4,20.12 119.33,19.05 SW11.1 112.17,19.05 111.1,17.98 105.31,17.98 104.24,19.05 SW10.1 104.09,19.05 103.02,17.98 100.13,17.98 99.06,19.05 SW9.1
  Bottom 0.152: SW9.1 87.17,19.05 77.11,8.99 76.2,8.99 J1.27
RF3
  Top 0.152: SW16.1 124.36,11.43 123.29,12.5 120.4,12.5 119.33,11.43 SW15.1 112.17,11.43 111.1,12.5 105.31,12.5 104.24,11.43 SW14.1 104.09,11.43 103.02,12.5 100.13,12.5 99.06,11.43 SW13.1 93.88,11.43 91.44,8.99 78.79,8.99 J1.28
RF4  (via drill 0.35)
  Top 0.152: R24.1 68.58,37.95 66.75,37.95 65.53,39.17 63.09,39.17 62.18,38.25 62.18,35.97 65.99,32.16 65.99,24.23 J2.23 | v80.47,20.12 99.36,20.12 100.43,19.05 SW9.2
  Bottom 0.152: 100.58,19.05 101.5,18.14 101.5,14.17 100.58,13.26 100.58,11.43 SW13.2 | 100.58,26.67 100.58,23.47 101.5,22.55 101.5,19.96 100.58,19.05 | 100.58,19.05 SW9.2 | 100.58,26.67 101.5,27.58 101.5,30.18 100.58,31.09 100.58,34.29 SW1.2 | 100.58,26.67 SW5.2 | v80.47,20.12 79.86,20.73 69.8,20.73 66.45,24.08 66.14,24.08 J2.23
RF5  (via drill 0.35)
  Top 0.152: 109.58,20.73 109.58,19.96 110.49,19.05 SW10.2 | 109.58,20.73 109.58,22.55 110.49,23.47 110.49,26.67 SW6.2 | R25.1 73.61,37.95 70.41,37.95 64.01,44.35 63.09,44.35 57.3,38.56 57.3,23.62 57.91,23.01 62.33,23.01 63.4,24.08 J2.22 | 109.58,20.73 80.16,20.73 v79.55,20.12
  Bottom 0.152: SW14.2 110.49,11.43 110.49,13.26 109.58,14.17 109.58,18.14 110.49,19.05 SW10.2 | SW2.2 110.49,34.29 110.49,31.09 109.58,30.18 109.58,27.58 110.49,26.67 SW6.2 | v79.55,20.12 78.94,19.51 70.26,19.51 66.75,23.01 64.62,23.01 J2.22
RF6  (via drill 0.35)
  Top 0.152: v86.11,37.8 78.79,37.8 R26.1
  Bottom 0.152: 120.7,19.05 119.79,18.14 119.79,14.17 120.7,13.26 120.7,11.43 SW15.2 | 120.7,26.67 120.7,23.47 119.79,22.55 119.79,19.96 120.7,19.05 | 120.7,19.05 SW11.2 | 120.7,34.29 117.2,37.8 v86.11,37.8 86.11,28.19 80.01,22.1 68.89,22.1 67.36,23.62 67.36,24.54 66.6,25.3 62.94,25.3 61.87,24.23 60.96,24.23 J2.21 | 120.7,26.67 120.7,28.5 119.79,29.41 119.79,33.38 120.7,34.29 | 120.7,26.67 SW7.2 | 120.7,34.29 SW3.2
RF7  (via drill 0.35)
  Top 0.152: 131.06,19.05 131.98,18.14 131.98,14.17 131.06,13.26 131.06,11.43 SW16.2 | 131.06,26.67 131.06,23.47 131.98,22.55 131.98,19.96 131.06,19.05 | 131.06,19.05 SW12.2 | 131.06,31.09 131.06,34.29 SW4.2 | 131.06,31.09 131.98,30.18 131.98,27.58 131.06,26.67 | 131.06,26.67 SW8.2 | v65.38,31.85 65.38,31.09 J2.20 | v122.38,31.09 131.06,31.09 | v85.5,41.15 83.82,42.82 R27.1
  Bottom 0.152: v65.38,31.85 67.06,30.18 69.04,30.18 69.49,30.63 69.49,31.55 68.89,32.16 68.89,33.38 71.93,36.42 73.61,36.42 80.01,42.82 83.82,42.82 R27.1 | v122.38,31.09 122.38,34.14 115.37,41.15 v85.5,41.15
VBUS  (via drill 0.35)
  Top 0.152: v110.49,59.28 110.49,77.57 109.73,78.33 76.2,78.33 62.94,91.59 20.73,91.59 18.44,89.31 17.68,89.31 LCD1.2 17.53,61.85 6.86,51.18 6.86,31.11 10.16,27.81 J2.01
  Bottom 0.152: 94.03,43.13 90.22,43.13 R22.1 | 94.03,43.13 94.79,42.37 99.52,42.37 R23.1 | v110.49,59.28 110.19,59.28 94.03,43.13
VO
  Top 0.152: R23.2 102.87,53.03 110.19,60.35 110.19,75.29 108.97,76.5 67.51,76.5 52.73,91.29 22.1,91.29 20.12,89.31 LCD1.3
VTG  (via drill 0.35)
  Top 0.152: 35.66,45.72 35.66,48.16 LED2.A 33.07,50.75 31.85,50.75 LED1.A | 35.66,45.72 35.66,43.28 LED3.A | 35.66,45.72 LED4.A | J2.06 22.86,24.08 23.77,24.08 24.84,23.01 28.5,23.01 29.26,23.77 29.26,25.91 35.51,32.16 35.51,32.92 LED7.A | R25.2 73.61,43.43 68.58,43.43 R24.2 68.58,43.59 67.51,44.65 62.94,44.65 54.86,36.58 v54.86,34.14 | 83.52,48.16 78.79,43.43 R26.2 | 83.52,48.16 83.82,48.46 R27.2 83.52,48.16 | U1.1 114.3,44.35 118.72,48.77 118.72,75.89 121.77,78.94 124.97,78.94 125.58,79.55 125.58,89 124.51,90.07 JP2.25 124.36,90.22 121.92,90.22 JP2.26 | v89.92,41.76 83.52,48.16
  Bottom 0.152: 31.85,39.01 31.85,40.54 LED5.A 31.85,40.69 31.85,45.72 LED4.A | 31.85,39.01 31.85,35.66 LED8.A | LED8.A 31.85,35.51 34.29,33.07 35.51,33.07 LED7.A 35.66,32.92 38.71,32.92 41.76,29.87 52.43,29.87 54.86,32.31 v54.86,34.14 | LED6.A 34.29,38.1 33.38,39.01 31.85,39.01 | IC1.10 26.67,30.48 LED8.A | R26.2 78.64,43.43 73.76,43.43 R25.2 | v89.92,41.76 112.93,41.76 114.3,43.13 U1.1
  pour Top: 0,100.33 0,0 149.86,0 149.86,100.33
(copper drawn outside any net)
  shapes: Top area x2